# Altium schematic sheet Main.SchDoc
size A4; SheetNumber: 1; SheetTotal: 4
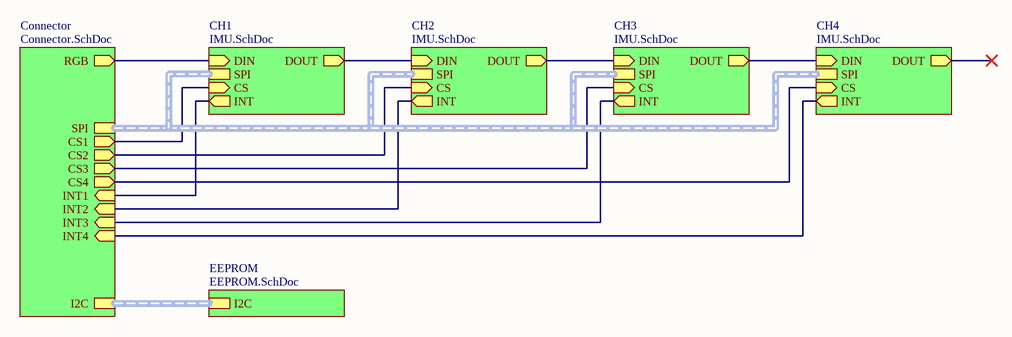
[diagram p0: Main.SchDoc]

## Sub-sheets
CH1 = IMU.SchDoc: DIN (in), DOUT (out), SPI (harness SPI), CS (in), INT (out)
CH2 = IMU.SchDoc: DIN (in), DOUT (out), SPI (harness SPI), CS (in), INT (out)
CH3 = IMU.SchDoc: DIN (in), DOUT (out), SPI (harness SPI), CS (in), INT (out)
CH4 = IMU.SchDoc: DIN (in), DOUT (out), SPI (harness SPI), CS (in), INT (out)
Connector = Connector.SchDoc: SPI (harness SPI), RGB (out), I2C (harness I2C), INT1 (in), CS1 (out), INT2 (in), CS2 (out), INT3 (in), CS3 (out), INT4 (in), CS4 (out)
EEPROM = EEPROM.SchDoc: I2C (harness I2C)

## Nets
(unnamed): sheet Connector/RGB, sheet CH1/DIN
(unnamed): sheet Connector/INT1, sheet CH1/INT
(unnamed): sheet Connector/CS1, sheet CH1/CS
(unnamed): sheet Connector/INT2, sheet CH2/INT
(unnamed): sheet Connector/CS2, sheet CH2/CS
(unnamed): sheet Connector/INT3, sheet CH3/INT
(unnamed): sheet Connector/CS3, sheet CH3/CS
(unnamed): sheet Connector/INT4, sheet CH4/INT
(unnamed): sheet Connector/CS4, sheet CH4/CS
(unnamed): sheet CH1/DOUT, sheet CH2/DIN
(unnamed): sheet CH2/DOUT, sheet CH3/DIN
(unnamed): sheet CH3/DOUT, sheet CH4/DIN

## Buses and harness runs
harness sheet CH1/SPI = sheet CH2/SPI = sheet CH3/SPI = sheet CH4/SPI = sheet Connector/SPI
harness sheet Connector/I2C = sheet EEPROM/I2C

## Notes on the sheet
- TITLE
- SIZE
- A4
- VARIANT
- PROJECT
- SHEET
- VERSION
- OF
- AUTHOR
- DATE